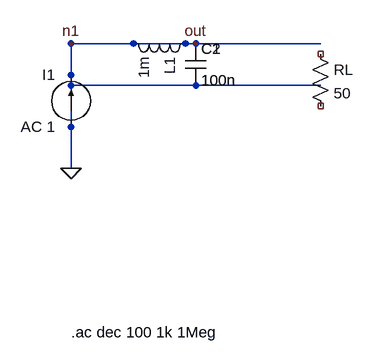
[diagram p0: schematic 00_converter_test_pi_filter.asc]
00_converter_test_pi_filter.asc, the LTspice schematic file:
Version 4
SHEET 1 880 736
WIRE 0 256 0 192
WIRE 192 192 0 192
WIRE 192 256 0 256
WIRE 0 256 0 384
WIRE 96 192 0 192
WIRE 384 192 192 192
WIRE 384 256 0 256
FLAG 0 384 0
FLAG 0 192 n1
FLAG 192 192 out
SYMBOL current 0 320 R180
WINDOW 0 24 80 Left 2
WINDOW 3 24 0 Left 2
SYMATTR InstName I1
SYMATTR Value AC 1
SYMBOL cap 176 192 R0
SYMATTR InstName C1
SYMATTR Value 100n
SYMBOL ind 192 176 R90
SYMATTR InstName L1
SYMATTR Value 1m
SYMBOL cap 176 192 R0
SYMATTR InstName C2
SYMATTR Value 100n
SYMBOL res 368 192 R0
SYMATTR InstName RL
SYMATTR Value 50
TEXT 0 636 Left 2 !.ac dec 100 1k 1Meg

The netlist it stands for:
* 00_converter_test_pi_filter.asc
I1 0 0 AC 1
C1 0 0 100n
L1 0 0 1m
C2 0 0 100n
RL NC_01 NC_02 50
.ac dec 100 1k 1Meg
.backanno
.end